# EAGLE design Tracksoar imu shield (EAGLE 7.3.0)
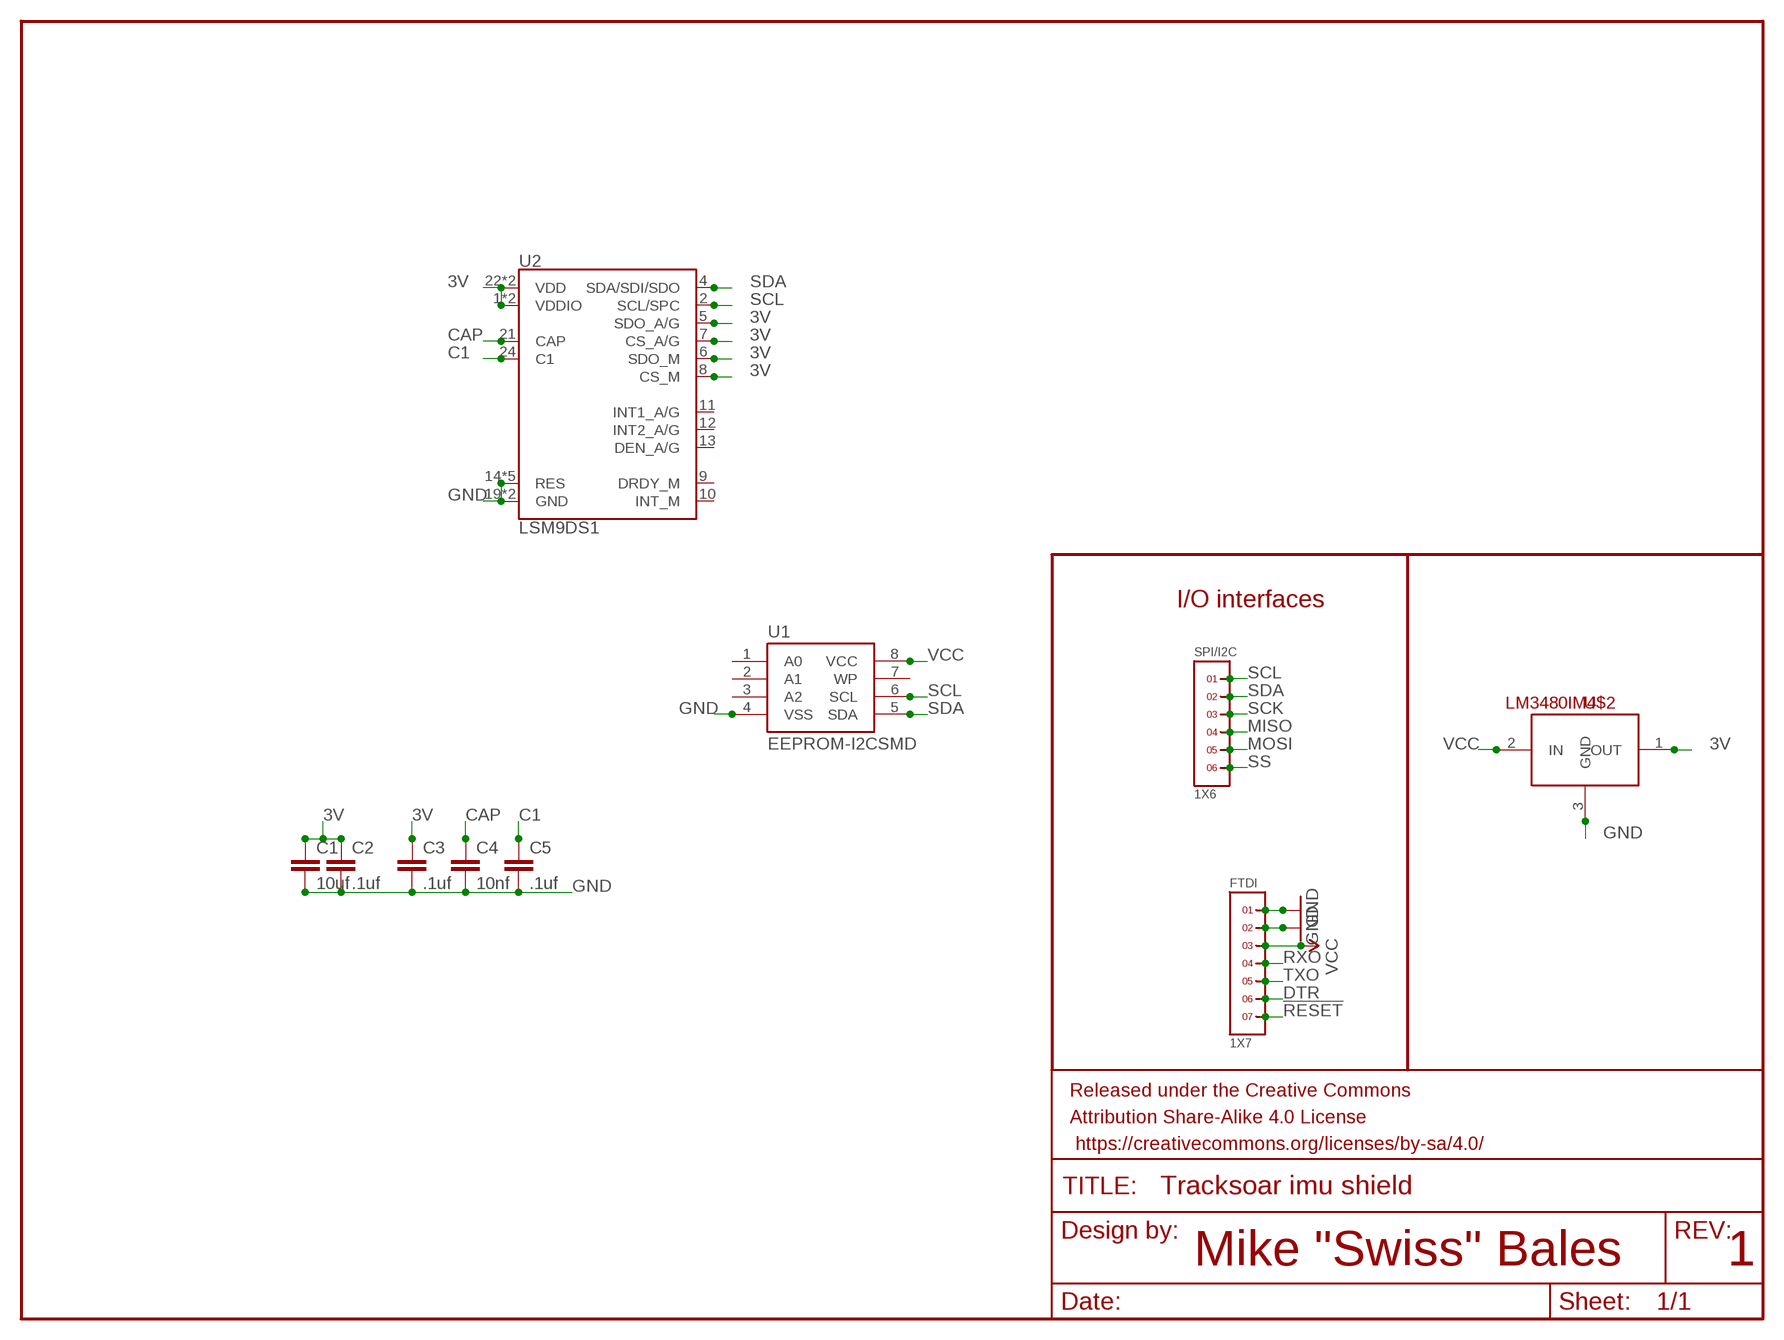
[diagram p0: schematic, sheet 1]

## Parts
C1  10uf  CAP0805  [0805]
C2  .1uf  CAP0805  [0805]
C3  .1uf  CAP0805  [0805]
C4  10nf  CAP0805  [0805]
C5  .1uf  CAP0805  [0805]
FRAME1  FRAME-LETTER  [CREATIVE_COMMONS]
FTDI  1X7  [1X7]
SPI/I2C  1X6  [1X6]
U1  EEPROM-I2CSMD  [SO08]
U2  LSM9DS1  [LGA24-8X4]
U$2  LM3480IM4  [SOT23-3]

## Nets
3V: C1.1 C2.1 C3.1 U2.1(VDDIO) U2.3(VDDIO) U2.5(SDO_A/G) U2.6(SDO_M) U2.7(CS_A/G) U2.8(CS_M) U2.22(VDD) U2.23(VDD) U$2.1(OUT)
!RESET: FTDI.7
C1: C5.1 U2.24(C1)
CAP: C4.1 U2.21(CAP)
DTR: FTDI.6
GND: C1.2 C2.2 C3.2 C4.2 C5.2 FTDI.1 FTDI.2 U1.4(VSS) U2.14(RES) U2.15(RES) U2.16(RES) U2.17(RES) U2.18(RES) U2.19(GND) U2.20(GND) U$2.3(GND)
MISO: SPI/I2C.4
MOSI: SPI/I2C.5
RXO: FTDI.4
SCK: SPI/I2C.3
SCL: SPI/I2C.1 U1.6(SCL) U2.2(SCL/SPC)
SDA: SPI/I2C.2 U1.5(SDA) U2.4(SDA/SDI/SDO)
SS: SPI/I2C.6
TXO: FTDI.5
VCC: FTDI.3 U1.8(VCC) U$2.2(IN)
Unconnected: U1.1(A0) U1.2(A1) U1.3(A2) U1.7(WP) U2.9(DRDY_M) U2.10(INT_M) U2.11(INT1_A/G) U2.12(INT2_A/G) U2.13(DEN_A/G)

## Notes on the sheet
- I/O interfaces
- Mike "Swiss" Bales | 1

## Library data of the parts
C1-C5 = SparkFun-Passives:CAP: Capacitor Standard 0603 ceramic capacitor, and 0.1" leaded capacitor.
FRAME1 = SparkFun-Aesthetics:FRAME-LETTER: Schematic Frame Standard 8.5x11 US Letter frame
FTDI = headers(2mm):1X7
SPI/I2C = headers(2mm):1X6
U1 = SparkFun-DigitalIC:EEPROM-I2C: I2C EEPROM chips, 24LC256 (and others)
U2 = SparkFun-Sensors:LSM9DS1: LSM9DS1 3D accelerometer, gyroscope & magnetometer The LSM9DS1 is a system-in-package featuring a 3D digital linear acceleration sensor, a 3D digital angular rate sensor, and a 3D digital magnetic sensor. The LSM9DS1 has a linear acceleration full scale of ±2g/±4g/±8/±16 g, a magnetic field full scale of ±4/±8/±12/±16 gauss and an angular rate of ±245/±500/±2000 dps. The LSM9DS1 includes an I2 C serial bus interface supporting standard and fast mode (100 kHz and 400 kHz) and an SPI serial standard interface. Magnetic, accelerometer and gyroscope sensing can be enabled or set in power-down mode separately for smart power management. The LSM9DS1 is available in a plastic land grid array package (LGA) and it is guaranteed to operate over an extended temperature range from -40 °C to +85 °C.; PROD_ID: IC-12536
U$2 = SparkFun-PowerIC:LM3480IM4: Small package linear regulator

## Board
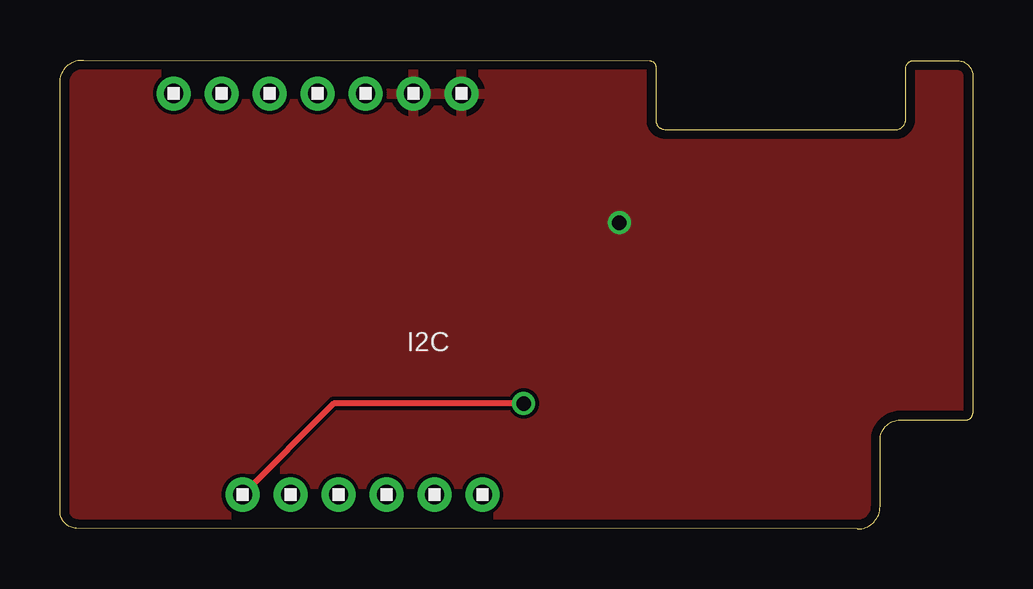
[diagram p1: board, top side]
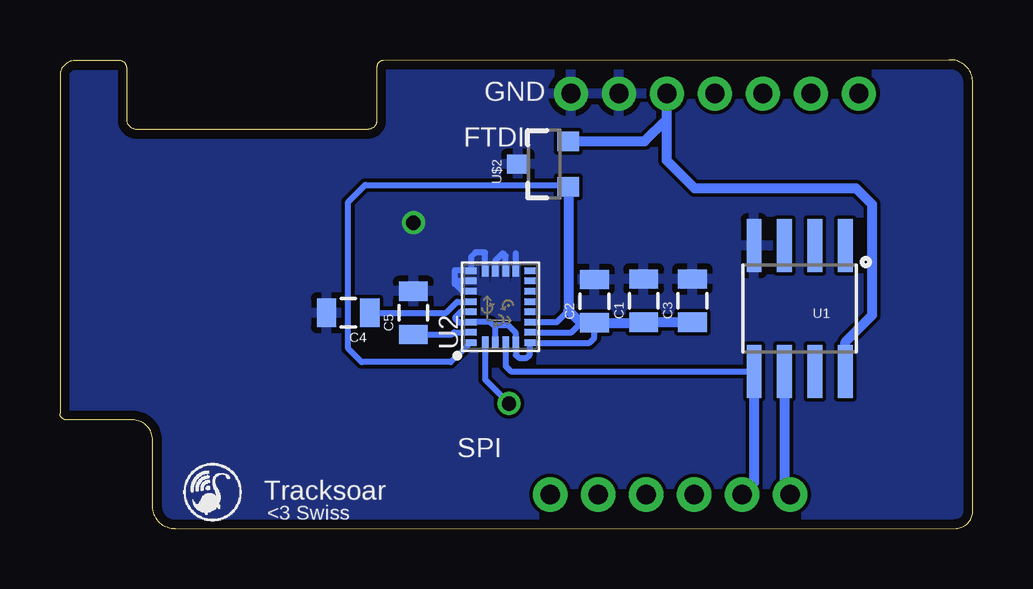
[diagram p2: board, bottom side, seen from below]

Size 38.05 x 19.56 mm. Coordinates in mm from the lower left corner, seen from the top.
Outline: 0.69,0.03 arc-90 0,0.79 0,18.69 arc-90 0.99,19.56 24.59,19.53 arc-90 24.84,19.23 24.84,17.02 arc90 25.25,16.66 34.75,16.66 arc90 35.26,17.02 35.26,19.23 arc-90 35.61,19.53 37.44,19.53 arc-90 38.05,18.87 38.05,4.83 arc-90 37.77,4.55 35.03,4.55 arc90 34.19,3.71 34.19,0.94 arc-90 33.25,0 0.69,0.03
Copper layers (1*16): Top 0.0356mm / dielectric 1.5011mm / Bottom 0.0356mm
Design rules "oshpark-2layer": minimum track width 6mil, minimum drill 13mil, track to track 6mil, track to pad 6mil, pad to pad 6mil, via to via 6mil, smd to smd 6mil, copper to edge 15mil, drill to drill 6mil, minimum pad ring 7mil, minimum via ring 7mil, stop-mask expansion 4mil, vias tented up to drill 0mil, thermal gap 10mil

### Footprints (pad centres in the part's own frame; a part is rotated, then mirrored left to right if it is on the bottom)
0805 = smd 0.8 x 1.2: 1 -0.9,0; 2 0.9,0
1X7 = drill 0.8 pad 1.422: 1 -6,0; 2 -4,0; 3 -2,0; 4 0,0; 5 2,0; 6 4,0; 7 6,0
1X6 = drill 0.8 pad 1.422: 1 -5,0; 2 -3,0; 3 -1,0; 4 1,0; 5 3,0; 6 5,0
SO08 = smd 0.61 x 2.21: 1 -1.905,-2.616; 2 -0.635,-2.616; 3 0.635,-2.616; 4 1.905,-2.616; 5 1.905,2.616; 6 0.635,2.616; 7 -0.635,2.616; 8 -1.905,2.616
LGA24-8X4 = smd 0.27 x 0.45: 1 -1.505,1.225; 6 -1.505,-1.225; 7 -1.075,-1.225; 8 -0.645,-1.225; 9 -0.215,-1.225; 10 0.215,-1.225; 11 0.645,-1.225; 12 1.075,-1.225; 13 1.505,-1.225; 18 1.505,1.225; 19 1.075,1.225; 20 0.645,1.225; 21 0.215,1.225; 22 -0.215,1.225; 23 -0.645,1.225; 24 -1.075,1.225 | smd 0.45 x 0.27: 2 -1.475,0.645; 3 -1.475,0.215; 4 -1.475,-0.215; 5 -1.475,-0.645; 14 1.475,-0.645; 15 1.475,-0.215; 16 1.475,0.215; 17 1.475,0.645
SOT23-3 = smd 0.8 x 0.9: 1 -0.95,-1; 2 0.95,-1; 3 0,1.1

### Placement (x,y rotation side)
C1  13.72,9.53 90 bottom
C2  15.77,9.5 90 bottom
C3  11.68,9.53 90 bottom
C4  26.04,9.02 180 bottom
C5  23.32,9.02 90 bottom
FRAME1  8.41,-8.18 0 top  (outside the outline)
FTDI  10.74,18.16 180 top
SPI/I2C  12.61,1.43 0 top
U1  7.21,9.19 180 bottom
U2  19.69,9.27 90 bottom
U$2  17.86,15.21 90 bottom

### Tracks (layer width: path | path; a pad name or v marks a point on that pad's centre or on a via)
3V
  Bottom 0.254: C2.1 15.77,7.98 15.98,7.77 U2.6 18.47,7.26 18.59,7.14 18.92,7.14 19.04,7.25 U2.5 19.04,8.17 19.36,8.48 19.84,8.48 19.9,8.42 | U2.7 16.72,8.2 16.33,8.59 | U2.8 17.34,8.63 16.86,9.11 | U2.22 21.35,9.06 21.57,8.84 21.57,8.76 21.41,8.61 20.93,8.61 U2.23 20.12,8.64 19.9,8.42 | U2.3 19.9,8.42 | U2.1 20.96,7.77 21.77,6.96 25.48,6.96 26.04,7.52 26.04,13.64 25.32,14.35 16.94,14.35 U$2.1
  Bottom 0.406: U$2.1 16.86,9.11 16.33,8.59 15.79,8.59 C2.1 13.74,8.6 C1.1 C3.1
C1
  Bottom 0.254: C5.1 21.7,8.12 21.62,8.2 U2.24
CAP
  Bottom 0.254: C4.1 21.95,9.02 21.49,9.47 U2.21
GND  (via drill 0.6)
  Bottom 0.254: U2.14 19.04,11.5 19.05,11.51 | U2.15 19.47,11.39 19.58,11.51 19.9,11.19 U2.16 | U2.17 20.33,11.52 20.35,11.53 20.73,11.53 20.9,11.35 U2.18 21.57,10.78 21.59,10.79 21.59,10.21 21.46,10.35 U2.19 21.48,10.35 21.59,10.24 21.27,9.92 U2.20
  other vias: 23.32,12.78
  pour Top: -0.02,19.51 -0.02,0.05 34.16,0.03 34.16,4.52 38.1,4.52 38.1,19.51 35.23,19.51 35.23,16.74 24.87,16.74 24.87,19.48
  pour Bottom: -0.02,19.51 -0.02,0.05 34.16,0.03 34.16,4.52 38.1,4.52 38.1,19.51 35.23,19.51 35.23,16.74 24.87,16.74 24.87,19.48
SCL  (via drill 0.6)
  Top 0.254: v19.33,5.23 11.41,5.23 SPI/I2C.1
  Bottom 0.254: U2.2 20.33,6.23 v19.33,5.23
  Bottom 0.406: U1.6 7.85,1.67 SPI/I2C.1
SDA
  Bottom 0.254: U2.4 19.47,6.8 19.25,6.58 U1.5
  Bottom 0.406: U1.5 9.12,1.93 SPI/I2C.2
VCC
  Bottom 0.406: U1.8 5.31,7.8 4.19,8.92 4.19,13.54 4.85,14.2 11.58,14.2 12.75,15.37 12.75,17.09 | 12.75,17.09 FTDI.3 | U$2.2 13.68,16.16 12.75,17.09

### Text on the board
tNames: I2C
bNames: GND | FTDI | SPI | Tracksoar | <3 Swiss